# Altium schematic sheet sd_mmc.SchDoc
size A4
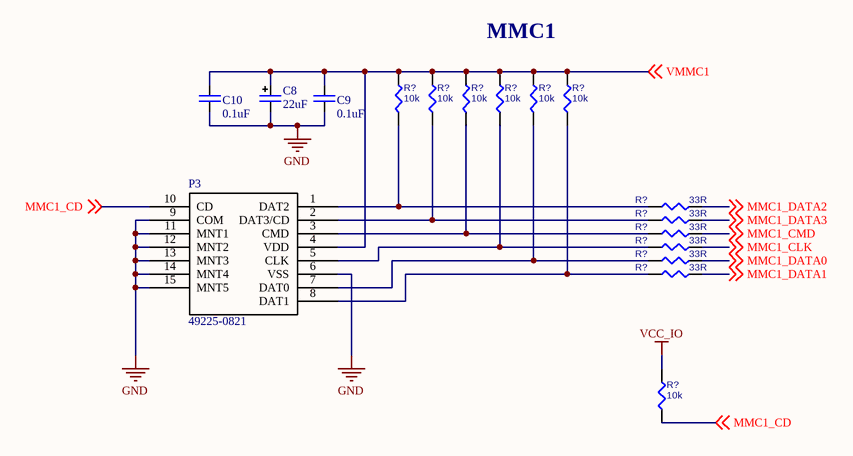
[diagram p0: sd_mmc.SchDoc]

## Parts
(Parts that share a designator on the sheet are numbered #1, #2 ... from top to bottom, then left to right.)
C8  value 22uF  [B]  (hidden comment: CAP B)
C9  value 0.1uF  [CHIP0603]  (hidden comment: C0603)
C10  value 0.1uF  [CHIP0603]  (hidden comment: C0603)
P3  49225-0821  [SDCard]
R?#1  value 10k  [CHIP0603]  (hidden comment: R0603)
R?#2  value 10k  [CHIP0603]  (hidden comment: R0603)
R?#3  value 10k  [CHIP0603]  (hidden comment: R0603)
R?#4  value 10k  [CHIP0603]  (hidden comment: R0603)
R?#5  value 10k  [CHIP0603]  (hidden comment: R0603)
R?#6  value 10k  [CHIP0603]  (hidden comment: R0603)
R?#7  value 33R  [CHIP0603]  (hidden comment: R0603)
R?#8  value 33R  [CHIP0603]  (hidden comment: R0603)
R?#9  value 33R  [CHIP0603]  (hidden comment: R0603)
R?#10  value 33R  [CHIP0603]  (hidden comment: R0603)
R?#11  value 33R  [CHIP0603]  (hidden comment: R0603)
R?#12  value 33R  [CHIP0603]  (hidden comment: R0603)
R?#13  value 10k  [CHIP0603]  (hidden comment: R0603)

## Nets
GND: C8.2 C9.2 C10.2 P3.6(VSS) P3.9(COM) P3.11(MNT1) P3.12(MNT2) P3.13(MNT3) P3.14(MNT4) P3.15(MNT5)
VCC_IO: R?#13.2
MMC1_CD: P3.10(CD) R?#13.1 ; off-sheet MMC1_CD
MMC1_CLK: R?#10.2 ; off-sheet MMC1_CLK
MMC1_CMD: R?#9.2 ; off-sheet MMC1_CMD
MMC1_DATA0: R?#11.2 ; off-sheet MMC1_DATA0
MMC1_DATA1: R?#12.2 ; off-sheet MMC1_DATA1
MMC1_DATA2: R?#7.2 ; off-sheet MMC1_DATA2
MMC1_DATA3: R?#8.2 ; off-sheet MMC1_DATA3
VMMC1: C8.1 C9.1 C10.1 P3.4(VDD) R?#1.2 R?#2.2 R?#3.2 R?#4.2 R?#5.2 R?#6.2 ; off-sheet VMMC1
NetP3_1: P3.1(DAT2) R?#1.1 R?#7.1
NetP3_2: P3.2(DAT3/CD) R?#2.1 R?#8.1
NetP3_3: P3.3(CMD) R?#3.1 R?#9.1
NetP3_5: P3.5(CLK) R?#4.1 R?#10.1
NetP3_7: P3.7(DAT0) R?#5.1 R?#11.1
NetP3_8: P3.8(DAT1) R?#6.1 R?#12.1

## Notes on the sheet
- (near R?#4) MMC1

## Library data of the parts
C8 = CAP B: Tantalum capacitor. Case B
C9 C10 = C0603: Ceramic capacitor C0603
P3 = Mol_49225-0821: Connector for microSD™ Card (Push-push Type); Manufacturer: Molex; Man P/N: 49225-0821
R?#1-R?#13 = R0603: Resistor 0603